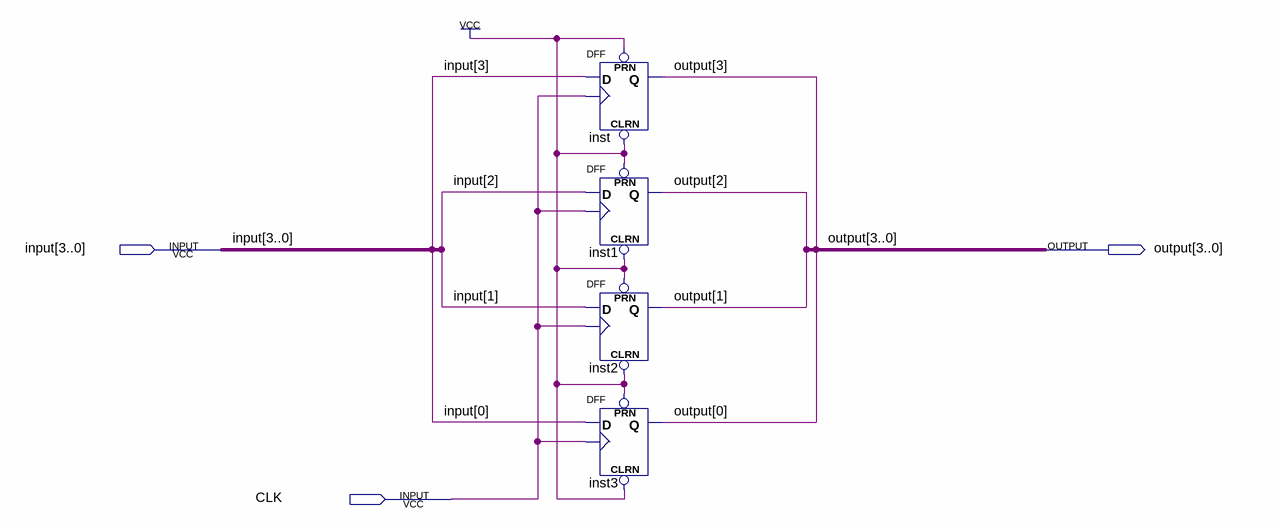
[diagram p0: schematic sheet]
// Quartus schematic reg4bits.bdf as structural Verilog: 4 symbols, 3 pins
module reg4bits (
  input  [3:0] \input ,
  input  CLK,
  output [3:0] \output 
);

  DFF inst (.CLRN(1'b1), .CLK(CLK), .D(\input [3]), .PRN(1'b1), .Q(\output [3]));
  DFF inst1 (.CLRN(1'b1), .CLK(CLK), .D(\input [2]), .PRN(1'b1), .Q(\output [2]));
  DFF inst2 (.CLRN(1'b1), .CLK(CLK), .D(\input [1]), .PRN(1'b1), .Q(\output [1]));
  DFF inst3 (.CLRN(1'b1), .CLK(CLK), .D(\input [0]), .PRN(1'b1), .Q(\output [0]));
endmodule
